# EAGLE design usb_shield (EAGLE 7.2.0)
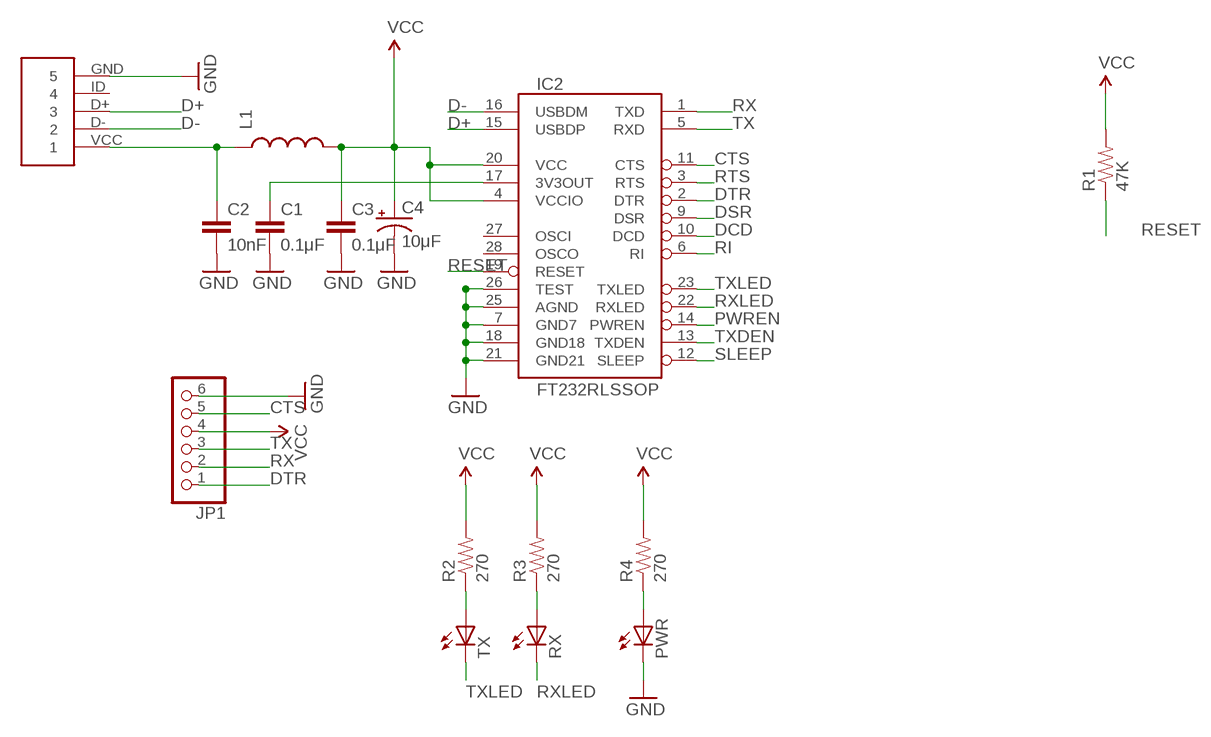
[diagram p0: schematic, sheet 1]

## Parts
C1  0.1μF  CAP0603-CAP  [0603-CAP]
C2  10nF  CAP0603-CAP  [0603-CAP]
C3  0.1μF  CAP0603-CAP  [0603-CAP]
C4  10μF  CAP_POL1206  [EIA3216]
IC2  FT232RLSSOP  [SSOP28DB]
JP1  PINHD-1X6  [1X06]
L1  INDUCTOR0603  [0603]
PWR  LEDCHIP-LED0805  [CHIP-LED0805]
R1  47K  RESISTOR0603-RES  [0603-RES]
R2  270  RESISTOR0603-RES  [0603-RES]
R3  270  RESISTOR0603-RES  [0603-RES]
R4  270  RESISTOR0603-RES  [0603-RES]
RX  LEDCHIP-LED0805  [CHIP-LED0805]
TX  LEDCHIP-LED0805  [CHIP-LED0805]
U$1  USB-MICRO-B-FEMALE  [USB-MICRO-B-FEMALE]

## Nets
3.3V: C1.1 IC2.17(3V3OUT)
CTS: IC2.11(CTS) JP1.5
D+: IC2.15(USBDP) U$1.D+
D-: IC2.16(USBDM) U$1.D-
DCD: IC2.10(DCD)
DSR: IC2.9(DSR)
DTR: IC2.2(DTR) JP1.1
GND: C1.2 C2.2 C3.2 C4.C(-) IC2.7(GND7) IC2.18(GND18) IC2.21(GND21) IC2.25(AGND) IC2.26(TEST) JP1.6 PWR.C U$1.GND
N$1: C2.1 L1.1 U$1.VCC
N$2: R2.1 TX.A
N$5: R3.1 RX.A
N$6: PWR.A R4.1
PWREN: IC2.14(PWREN)
RESET: IC2.19(RESET) R1.1
RI: IC2.6(RI)
RTS: IC2.3(RTS)
RX: IC2.1(TXD) JP1.2
RXLED: IC2.22(RXLED) RX.C
SLEEP: IC2.12(SLEEP)
TX: IC2.5(RXD) JP1.3
TXDEN: IC2.13(TXDEN)
TXLED: IC2.23(TXLED) TX.C
VCC: C3.1 C4.A(+) IC2.4(VCCIO) IC2.20(VCC) JP1.4 L1.2 R1.2 R2.2 R3.2 R4.2
Unconnected: IC2.27(OSCI) IC2.28(OSCO) U$1.ID

## Library data of the parts
C1-C3 = SparkFun:CAP: Capacitor Standard 0603 ceramic capacitor, and 0.1" leaded capacitor.
C4 = SparkFun:CAP_POL: Capacitor Polarized These are standard SMD and PTH capacitors. Normally 10uF, 47uF, and 100uF in electrolytic and tantalum varieties. Always verify the external diameter of the through hole cap, it varies with capacity, voltage, and manufacturer. The EIA devices should be standard.
IC2 = SparkFun:FT232RL: USB UART FT232RL 4th Generation USB UART (USB <-> Serial) Controller. Spark Fun Electronics SKU : COM-00650
JP1 = adafruit:PINHD-1X6: PIN HEADER
L1 = SparkFun:INDUCTOR: Inductors Basic Inductor/Choke - 0603 and 1206. Footprints are not proven and vary greatly between part numbers.
PWR RX TX = adafruit:LED: LED OSRAM: - CHIPLED LG R971, LG N971, LY N971, LG Q971, LY Q971, LO R971, LY R971 LH N974, LH R974 LS Q976, LO Q976, LY Q976 LO Q996 - Hyper CHIPLED LW Q18S LB Q993, LB Q99A, LB R99A - SideLED LS A670, LO A670, LY A670, LG A670, LP A670 LB A673, LV A673, LT A673, LW A673 LH A674 LY A675 LS A676, LA A676, LO A676, LY A676, LW A676 LS A679, LY A679, LG A679 - Hyper Micro SIDELED® LS Y876, LA Y876, LO Y876, LY Y876 LT Y87S - SmartLED LW L88C, LW L88S LB L89C, LB L89S, LG L890 LS L89K, LO L89K, LY L89K LS L896, LA L896, LO L896, LY L896 - TOPLED LS T670, LO T670, LY T670, LG T670, LP T670 LSG T670, LSP T670, LSY T670, LOP T670, LYG T670 LG T671, LOG T671, LSG T671 LB T673, LV T673, LT T673, LW T673 LH T674 LS T676, LA T676, LO T676, LY T676, LB T676, LH T676, LSB T676, LW T676 LB T67C, LV T67C, LT T67C, LS T67K, LO T67K, LY T67K, LW E67C LS E67B, LA E67B, LO E67B, LY E67B, LB E67C, LV E67C, LT E67C LW T67C LS T679, LY T679, LG T679 LS T770, LO T770, LY T770, LG T770, LP T770 LB T773, LV T773, LT T773, LW T773 LH T774 LS E675, LA E675, LY E675, LS T675 LS T776, LA T776, LO T776, LY T776, LB T776 LHGB T686 LT T68C, LB T68C - Hyper Mini TOPLED® LB M676 - Mini TOPLED Santana® LG M470 LS M47K, LO M47K, LY M47K Source: http://www.osram.convergy.de/
R1-R4 = SparkFun:RESISTOR: Resistor Basic schematic elements and footprints for 0603, 1206, and PTH resistors.
U$1 = gclue:USB-MICRO-B-FEMALE

## Board
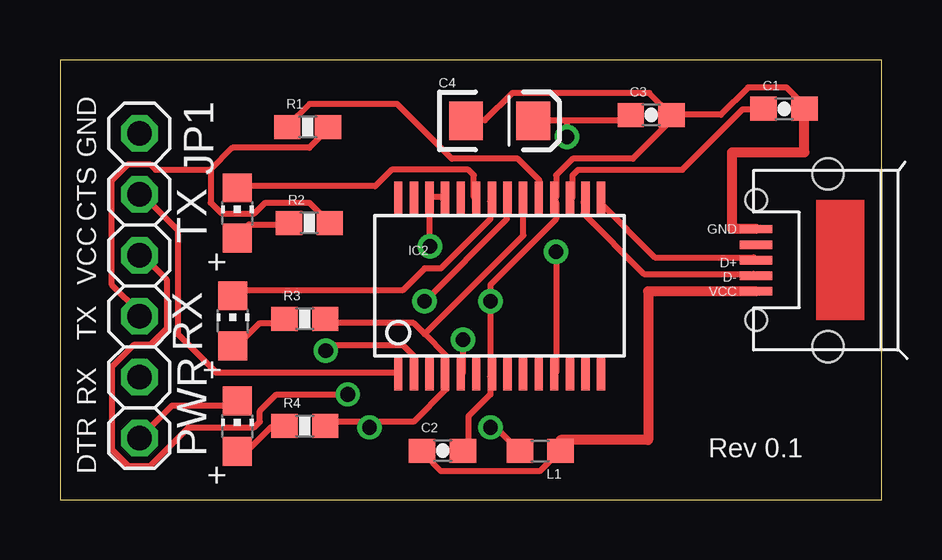
[diagram p1: board, top side]
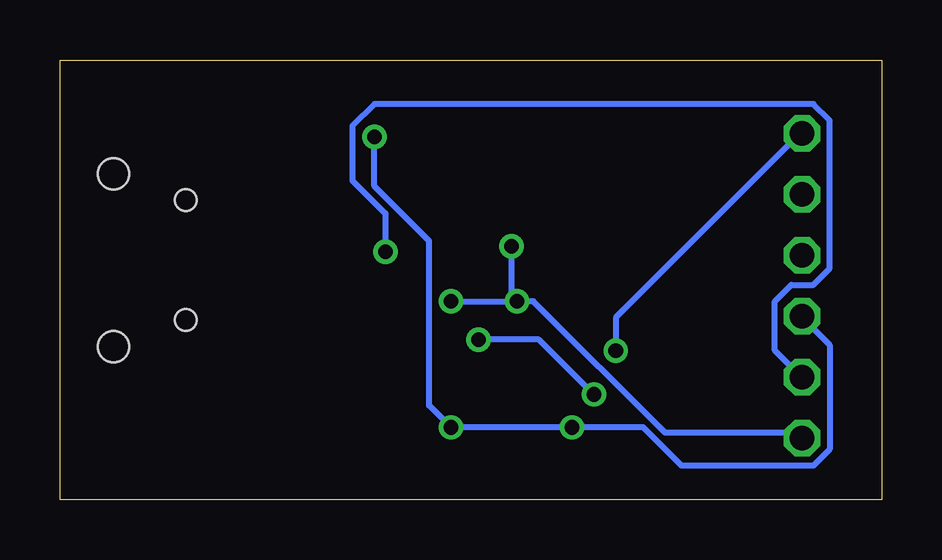
[diagram p2: board, bottom side, seen from below]

Size 34.23 x 18.35 mm. Coordinates in mm from the lower left corner, seen from the top.
Outline: 0,0 34.23,0 34.23,18.35 0,18.35 0,0
Copper layers (1*16): Top 0.035mm / dielectric 1.5mm / Bottom 0.035mm
Design rules "default": minimum track width 10mil, minimum drill 24mil, track to track 8mil, track to pad 8mil, pad to pad 8mil, via to via 8mil, smd to smd 8mil, copper to edge 40mil, drill to drill 8mil, minimum pad ring 10mil, minimum via ring 8mil, stop-mask expansion 4mil, vias tented up to drill 0mil, thermal gap 10mil

### Footprints (pad centres in the part's own frame; a part is rotated, then mirrored left to right if it is on the bottom)
0603-CAP = smd 1.1 x 1: 1 -0.85,0; 2 0.85,0
EIA3216 = smd 1.4 x 1.6: A 1.4,0; C -1.4,0
SSOP28DB = smd 0.348 x 1.397: 1 -4.225,-3.656; 2 -3.575,-3.656; 3 -2.925,-3.656; 4 -2.275,-3.656; 5 -1.625,-3.656; 6 -0.975,-3.656; 7 -0.325,-3.656; 8 0.325,-3.656; 9 0.975,-3.656; 10 1.625,-3.656; 11 2.275,-3.656; 12 2.925,-3.656; 13 3.575,-3.656; 14 4.225,-3.656; 15 4.225,3.656; 16 3.575,3.656; 17 2.925,3.656; 18 2.275,3.656; 19 1.625,3.656; 20 0.975,3.656; 21 0.325,3.656; 22 -0.325,3.656; 23 -0.975,3.656; 24 -1.625,3.656; 25 -2.275,3.656; 26 -2.925,3.656; 27 -3.575,3.656; 28 -4.225,3.656
1X06 = drill 1.016 octagon: 1 -6.35,0; 2 -3.81,0; 3 -1.27,0; 4 1.27,0; 5 3.81,0; 6 6.35,0
0603 = smd 1.1 x 1: 1 -0.85,0; 2 0.85,0
CHIP-LED0805 = smd 1.2 x 1.2: A 0,-1.05; C 0,1.05
0603-RES = smd 1.1 x 1: 1 -0.85,0; 2 0.85,0
USB-MICRO-B-FEMALE = smd 1.35 x 0.35: D+ 3,0; D- 3,0.65; GND 3,-1.3; ID 3,-0.65; VCC 3,1.3 | hole 1.3: 0,3.6; 0,-3.6 | hole 0.9: 3,2.5; 3,-2.5

### Placement (x,y rotation side)
C1  0.1uf  [0603-CAP]  30.17,16.31 0 top
C2  15.94,2.05 0 top
C3  0.1uf  [0603-CAP]  24.63,16.05 0 top
C4  10uf  [EIA3216]  18.32,15.81 0 top
IC2  18.32,8.93 0 top
JP1  3.31,8.93 270 top
L1  20.01,2.05 180 top
PWR  7.39,3.08 0 top
R1  10.32,15.55 0 top
R2  10.39,11.55 0 top
R3  10.2,7.55 0 top
R4  10.2,3.08 0 top
RX  7.2,7.47 0 top
TX  7.39,11.97 0 top
U$1  32,10 180 top

### Tracks (layer width: path | path; a pad name or v marks a point on that pad's centre or on a via)
3.3V
  Top 0.254: C1.1 29.13,16.29 28.45,16.29 25.93,13.77 21.59,13.77 21.36,13.54 21.36,12.63 IC2.17
CTS  (via drill 0.61)
  Top 0.254: v20.67,10.34 20.67,5.32 IC2.11
  Bottom 0.254: v20.67,10.34 20.67,11.95 22.05,13.32 22.05,15.6 21.13,16.52 2.84,16.52 2.16,15.83 2.16,9.66 2.84,8.97 3.76,8.97 4.44,8.29 4.44,6.23 3.53,5.32 JP1.5
D+
  Top 0.254: U$1.D+ 28.9,10.12 24.79,10.12 22.5,12.4 IC2.15
D-
  Top 0.254: U$1.D- 28.9,9.43 24.33,9.43 21.82,11.95 21.82,12.4 IC2.16
DTR  (via drill 0.61)
  Top 0.254: v11.07,6.23 11.3,6.46 14.27,6.46 14.73,6 14.73,5.32 IC2.2
  Bottom 0.254: v11.07,6.23 11.07,7.6 3.53,15.14 JP1.1
GND  (via drill 0.61)
  Top 0.254: IC2.25 15.87,12.63 15.42,12.63 IC2.26 15.42,12.4 v15.42,10.57 | PWR.C 7.19,3.94 4.67,3.94 3.53,2.8 JP1.6 | v15.19,8.29 18.62,11.72 18.62,12.4 IC2.21 | C2.2 17.02,2.12 17.02,3.49 17.93,4.4 17.93,5.09 IC2.7 17.93,5.32 v17.93,8.29 17.93,8.97 20.67,11.72 20.67,12.4 IC2.18 20.67,12.63 20.67,13.54 21.36,14.23 23.88,14.23 25.48,15.83 C3.2 | C3.2 25.7,16.06 27.53,16.06 28.68,17.2 30.27,17.2 30.96,16.52 C1.2 | C4.C 17.02,15.83 17.7,15.83 18.84,16.97 24.56,16.97 C3.2
  Top 0.406: U$1.GND 28,11.3 28,14.5 31.02,14.5 C1.2
  Bottom 0.254: v15.19,8.29 14.5,8.29 9.02,2.8 3.53,2.8 JP1.6 | v15.42,10.57 15.42,8.52 v15.19,8.29 | v17.93,8.29 v15.19,8.29
N$1
  Top 0.254: C2.1 15.19,1.89 15.87,1.2 19.99,1.2 20.67,1.89 L1.1
  Top 0.406: U$1.VCC 24.5,8.7 24.5,2.5 20.86,2.5 L1.1
N$2
  Top 0.254: R2.1 9.47,11.49 7.87,11.49 7.41,11.03 TX.A
N$5
  Top 0.254: R3.1 9.24,7.37 8.33,7.37 7.41,6.46 RX.A
N$6
  Top 0.254: R4.1 9.24,3.03 8.79,3.03 7.87,2.12 7.41,2.12 PWR.A
RESET
  Top 0.254: R1.1 9.47,15.6 10.39,16.52 14.04,16.52 16.33,14.23 19.07,14.23 19.99,13.32 19.99,12.63 IC2.19
RX
  Top 0.254: IC2.1 14.04,5.32 6.5,5.32 4.9,6.91 4.9,11.26 3.53,12.63 JP1.2
RXLED
  Top 0.254: RX.C 7.41,8.74 14.27,8.74 15.19,9.66 15.87,9.66 17.93,11.72 17.93,12.4 IC2.22
TX  (via drill 0.61)
  Top 0.254: v16.79,6.69 16.79,5.32 IC2.5 | v11.99,4.4 9.02,4.4 8.33,3.71 8.33,3.26 8.1,3.03 5.36,3.03 3.76,1.43 2.84,1.43 2.16,2.12 2.16,5.54 3.07,6.46 3.76,6.46 4.44,7.14 4.44,9.2 3.53,10.12 JP1.3
  Bottom 0.254: v16.79,6.69 14.27,6.69 v11.99,4.4
TXLED
  Top 0.254: TX.C 7.41,13.09 13.13,13.09 13.82,13.77 17.02,13.77 17.25,13.54 17.25,12.63 IC2.23
VCC  (via drill 0.61)
  Top 0.254: 12.9,3.26 14.73,3.26 16.1,4.63 16.1,5.09 IC2.4 16.1,5.32 16.1,6 15.19,6.91 | 12.9,3.26 11.07,3.26 R4.2 | 15.19,6.91 14.73,7.37 11.07,7.37 R3.2 | 15.19,6.91 19.3,11.03 19.3,12.4 IC2.20 | 6.27,13.77 6.27,12.4 6.73,11.95 8.1,11.95 8.56,12.4 10.39,12.4 11.07,11.72 R2.2 | 6.27,13.77 7.19,14.69 10.39,14.69 11.07,15.37 R1.2 | 21.13,15.83 19.76,15.83 C4.A | 21.13,15.83 23.65,15.83 C3.1 | v17.93,3.03 18.16,3.03 19.07,2.12 L1.2 | v21.13,15.14 21.13,15.83 | 6.27,13.77 3.99,13.77 3.76,14 2.84,14 2.16,13.32 2.16,8.97 3.3,7.83 JP1.4 | v12.9,3.03 12.9,3.26
  Bottom 0.254: JP1.4 3.3,7.6 2.16,6.46 2.16,2.12 2.84,1.43 8.33,1.43 9.93,3.03 v12.9,3.03 v17.93,3.03 18.84,3.94 18.84,10.8 21.13,13.09 v21.13,15.14
(copper drawn outside any net)
  shapes: Top area x1

### Text on the board
tPlace: GND | CTS | VCC | TX | RX | Rev 0.1 | DTR